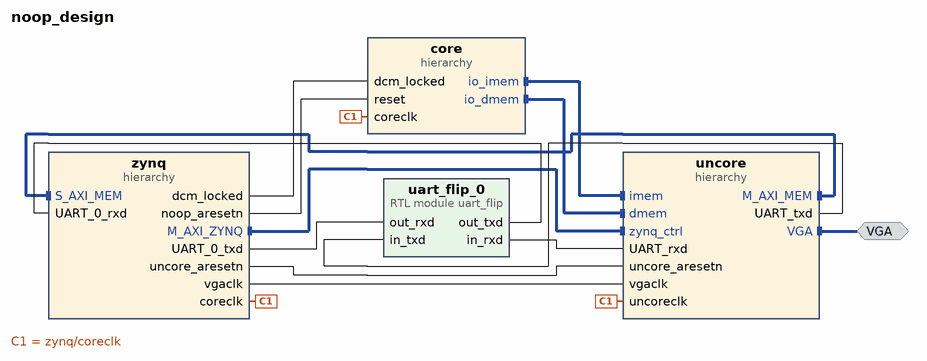
[diagram p0: block diagram of the top level]
# Vivado block design noop_design, xc7z020clg484-1, Vivado 2018.1
create_bd_design noop_design

create_bd_intf_port -mode Master -vlnv xilinx.com:interface:vga_rtl:1.0 VGA

create_bd_cell -type hier core
create_bd_cell -type hier zynq
create_bd_cell -type hier uncore
create_bd_cell -type module -reference uart_flip uart_flip_0

# ---- hierarchy /core ----
current_bd_instance /core
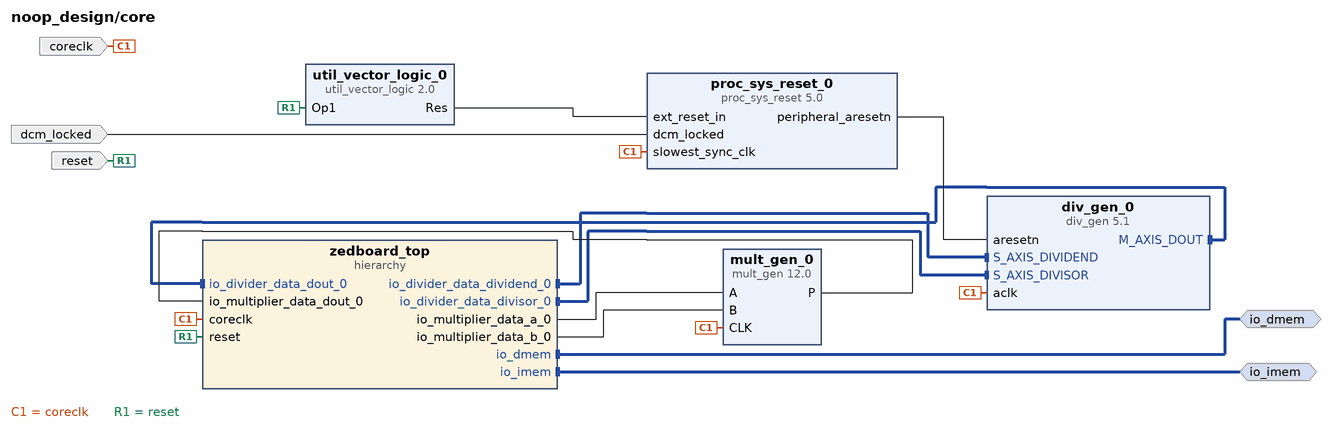
[diagram p1: block diagram inside /core]
create_bd_intf_pin -mode Master -vlnv xilinx.com:interface:aximm_rtl:1.0 io_dmem
create_bd_intf_pin -mode Master -vlnv xilinx.com:interface:aximm_rtl:1.0 io_imem
create_bd_pin -dir I -type clk coreclk
create_bd_pin -dir I -type rst reset
create_bd_pin -dir I dcm_locked

create_bd_cell -type ip -vlnv xilinx.com:ip:mult_gen:12.0 mult_gen_0
set_property -dict [list \
  CONFIG.PortAType Signed \
  CONFIG.PortAWidth 33 \
  CONFIG.PortBWidth 33 \
  CONFIG.Multiplier_Construction Use_Mults \
  CONFIG.OptGoal Area \
  CONFIG.PipeStages 7 \
] [get_bd_cells mult_gen_0]
create_bd_cell -type ip -vlnv xilinx.com:ip:util_vector_logic:2.0 util_vector_logic_0
set_property -dict {CONFIG.C_SIZE 1 CONFIG.C_OPERATION not} [get_bd_cells util_vector_logic_0]
create_bd_cell -type ip -vlnv xilinx.com:ip:div_gen:5.1 div_gen_0
set_property -dict [list \
  CONFIG.algorithm_type Radix2 \
  CONFIG.dividend_and_quotient_width 40 \
  CONFIG.divisor_width 40 \
  CONFIG.divisor_has_tlast false \
  CONFIG.remainder_type Remainder \
  CONFIG.fractional_width 40 \
  CONFIG.clocks_per_division 8 \
  CONFIG.divide_by_zero_detect false \
  CONFIG.FlowControl Blocking \
  CONFIG.OptimizeGoal Resources \
  CONFIG.OutTready false \
  CONFIG.OutTLASTBehv Null \
  CONFIG.latency_configuration Automatic \
  CONFIG.latency 46 \
  CONFIG.ARESETN true \
] [get_bd_cells div_gen_0]
create_bd_cell -type ip -vlnv xilinx.com:ip:proc_sys_reset:5.0 proc_sys_reset_0
create_bd_cell -type hier zedboard_top

# ---- hierarchy /core/zedboard_top ----
current_bd_instance /core/zedboard_top
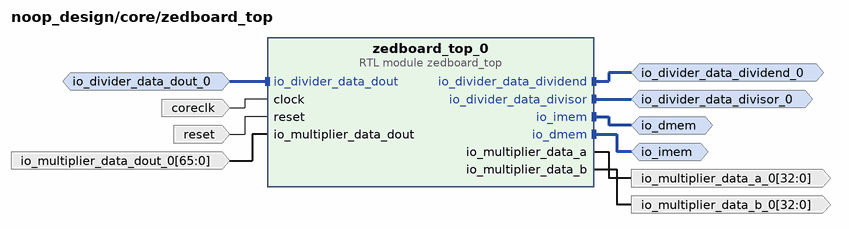
[diagram p2: block diagram inside /core/zedboard_top]
create_bd_intf_pin -mode Master -vlnv xilinx.com:interface:aximm_rtl:1.0 io_dmem
create_bd_intf_pin -mode Master -vlnv xilinx.com:interface:aximm_rtl:1.0 io_imem
create_bd_intf_pin -mode Master -vlnv xilinx.com:interface:axis_rtl:1.0 io_divider_data_dividend_0
create_bd_intf_pin -mode Master -vlnv xilinx.com:interface:axis_rtl:1.0 io_divider_data_divisor_0
create_bd_intf_pin -mode Slave -vlnv xilinx.com:interface:axis_rtl:1.0 io_divider_data_dout_0
create_bd_pin -dir I -type clk coreclk
create_bd_pin -dir I -type rst reset
create_bd_pin -dir I -from 65 -to 0 io_multiplier_data_dout_0
create_bd_pin -dir O -from 32 -to 0 io_multiplier_data_a_0
create_bd_pin -dir O -from 32 -to 0 io_multiplier_data_b_0

create_bd_cell -type module -reference zedboard_top zedboard_top_0

# ---- hierarchy /zynq ----
current_bd_instance /zynq
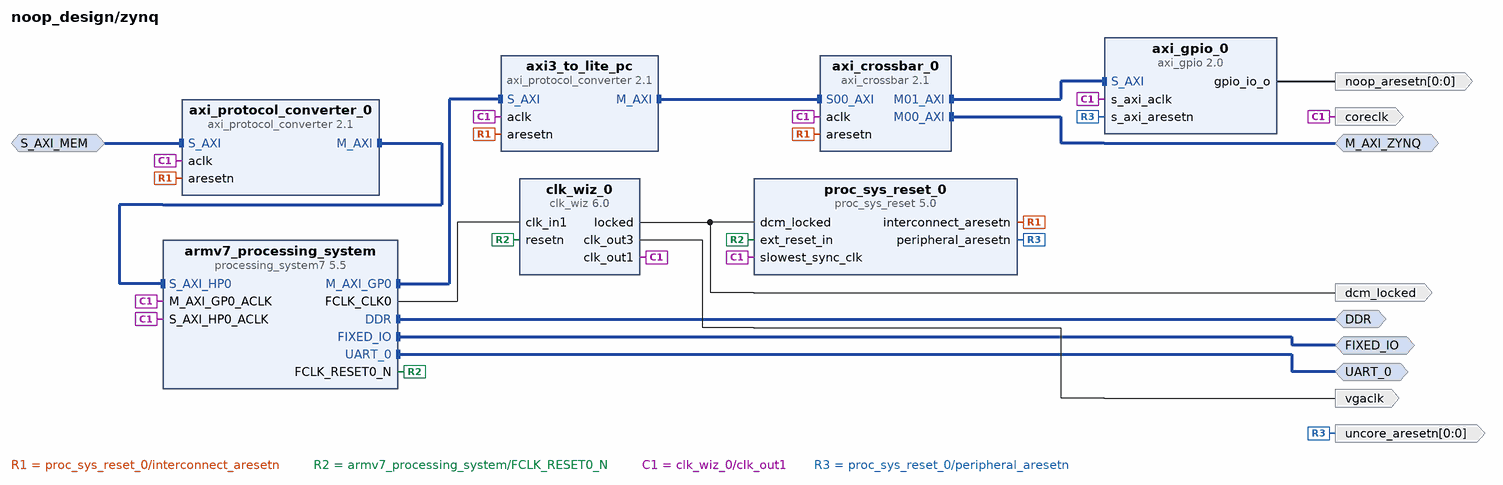
[diagram p3: block diagram inside /zynq]
create_bd_intf_pin -mode Slave -vlnv xilinx.com:interface:aximm_rtl:1.0 S_AXI_MEM
create_bd_intf_pin -mode Master -vlnv xilinx.com:interface:aximm_rtl:1.0 M_AXI_ZYNQ
create_bd_intf_pin -mode Master -vlnv xilinx.com:interface:ddrx_rtl:1.0 DDR
create_bd_intf_pin -mode Master -vlnv xilinx.com:display_processing_system7:fixedio_rtl:1.0 FIXED_IO
create_bd_intf_pin -mode Master -vlnv xilinx.com:interface:uart_rtl:1.0 UART_0
create_bd_pin -dir O -type clk coreclk
create_bd_pin -dir O -from 0 -to 0 -type rst uncore_aresetn
create_bd_pin -dir O -from 0 -to 0 noop_aresetn
create_bd_pin -dir O dcm_locked
create_bd_pin -dir O -type clk vgaclk

create_bd_cell -type ip -vlnv xilinx.com:ip:axi_protocol_converter:2.1 axi_protocol_converter_0
create_bd_cell -type ip -vlnv xilinx.com:ip:axi_crossbar:2.1 axi_crossbar_0
set_property -dict [list \
  CONFIG.M00_A00_BASE_ADDR 0xffffffffffffffff \
  CONFIG.M00_A01_BASE_ADDR 0xffffffffffffffff \
  CONFIG.M00_A02_BASE_ADDR 0xffffffffffffffff \
  CONFIG.M00_A03_BASE_ADDR 0xffffffffffffffff \
  CONFIG.M00_A04_BASE_ADDR 0xffffffffffffffff \
  CONFIG.M00_A05_BASE_ADDR 0xffffffffffffffff \
  CONFIG.M00_A06_BASE_ADDR 0xffffffffffffffff \
  CONFIG.M00_A07_BASE_ADDR 0xffffffffffffffff \
  CONFIG.M00_A08_BASE_ADDR 0xffffffffffffffff \
  CONFIG.M00_A09_BASE_ADDR 0xffffffffffffffff \
  CONFIG.M00_A10_BASE_ADDR 0xffffffffffffffff \
  CONFIG.M00_A11_BASE_ADDR 0xffffffffffffffff \
  CONFIG.M00_A12_BASE_ADDR 0xffffffffffffffff \
  CONFIG.M00_A13_BASE_ADDR 0xffffffffffffffff \
  CONFIG.M00_A14_BASE_ADDR 0xffffffffffffffff \
  CONFIG.M00_A15_BASE_ADDR 0xffffffffffffffff \
  CONFIG.M01_A00_BASE_ADDR 0xffffffffffffffff \
  CONFIG.M01_A01_BASE_ADDR 0xffffffffffffffff \
  CONFIG.M01_A02_BASE_ADDR 0xffffffffffffffff \
  CONFIG.M01_A03_BASE_ADDR 0xffffffffffffffff \
  CONFIG.M01_A04_BASE_ADDR 0xffffffffffffffff \
  CONFIG.M01_A05_BASE_ADDR 0xffffffffffffffff \
  CONFIG.M01_A06_BASE_ADDR 0xffffffffffffffff \
  CONFIG.M01_A07_BASE_ADDR 0xffffffffffffffff \
  CONFIG.M01_A08_BASE_ADDR 0xffffffffffffffff \
  CONFIG.M01_A09_BASE_ADDR 0xffffffffffffffff \
  CONFIG.M01_A10_BASE_ADDR 0xffffffffffffffff \
  CONFIG.M01_A11_BASE_ADDR 0xffffffffffffffff \
  CONFIG.M01_A12_BASE_ADDR 0xffffffffffffffff \
  CONFIG.M01_A13_BASE_ADDR 0xffffffffffffffff \
  CONFIG.M01_A14_BASE_ADDR 0xffffffffffffffff \
  CONFIG.M01_A15_BASE_ADDR 0xffffffffffffffff \
  CONFIG.M02_A00_BASE_ADDR 0xffffffffffffffff \
  CONFIG.M02_A01_BASE_ADDR 0xffffffffffffffff \
  CONFIG.M02_A02_BASE_ADDR 0xffffffffffffffff \
  CONFIG.M02_A03_BASE_ADDR 0xffffffffffffffff \
  CONFIG.M02_A04_BASE_ADDR 0xffffffffffffffff \
  CONFIG.M02_A05_BASE_ADDR 0xffffffffffffffff \
  CONFIG.M02_A06_BASE_ADDR 0xffffffffffffffff \
  CONFIG.M02_A07_BASE_ADDR 0xffffffffffffffff \
  CONFIG.M02_A08_BASE_ADDR 0xffffffffffffffff \
  CONFIG.M02_A09_BASE_ADDR 0xffffffffffffffff \
  CONFIG.M02_A10_BASE_ADDR 0xffffffffffffffff \
  CONFIG.M02_A11_BASE_ADDR 0xffffffffffffffff \
  CONFIG.M02_A12_BASE_ADDR 0xffffffffffffffff \
  CONFIG.M02_A13_BASE_ADDR 0xffffffffffffffff \
  CONFIG.M02_A14_BASE_ADDR 0xffffffffffffffff \
  CONFIG.M02_A15_BASE_ADDR 0xffffffffffffffff \
  CONFIG.M03_A00_BASE_ADDR 0xffffffffffffffff \
  CONFIG.M03_A01_BASE_ADDR 0xffffffffffffffff \
  CONFIG.M03_A02_BASE_ADDR 0xffffffffffffffff \
  CONFIG.M03_A03_BASE_ADDR 0xffffffffffffffff \
  CONFIG.M03_A04_BASE_ADDR 0xffffffffffffffff \
  CONFIG.M03_A05_BASE_ADDR 0xffffffffffffffff \
  CONFIG.M03_A06_BASE_ADDR 0xffffffffffffffff \
  CONFIG.M03_A07_BASE_ADDR 0xffffffffffffffff \
  CONFIG.M03_A08_BASE_ADDR 0xffffffffffffffff \
  CONFIG.M03_A09_BASE_ADDR 0xffffffffffffffff \
  CONFIG.M03_A10_BASE_ADDR 0xffffffffffffffff \
  CONFIG.M03_A11_BASE_ADDR 0xffffffffffffffff \
  CONFIG.M03_A12_BASE_ADDR 0xffffffffffffffff \
  CONFIG.M03_A13_BASE_ADDR 0xffffffffffffffff \
  CONFIG.M03_A14_BASE_ADDR 0xffffffffffffffff \
  CONFIG.M03_A15_BASE_ADDR 0xffffffffffffffff \
  CONFIG.M04_A00_BASE_ADDR 0xffffffffffffffff \
  CONFIG.M04_A01_BASE_ADDR 0xffffffffffffffff \
  CONFIG.M04_A02_BASE_ADDR 0xffffffffffffffff \
  CONFIG.M04_A03_BASE_ADDR 0xffffffffffffffff \
  CONFIG.M04_A04_BASE_ADDR 0xffffffffffffffff \
  CONFIG.M04_A05_BASE_ADDR 0xffffffffffffffff \
  CONFIG.M04_A06_BASE_ADDR 0xffffffffffffffff \
  CONFIG.M04_A07_BASE_ADDR 0xffffffffffffffff \
  CONFIG.M04_A08_BASE_ADDR 0xffffffffffffffff \
  CONFIG.M04_A09_BASE_ADDR 0xffffffffffffffff \
  CONFIG.M04_A10_BASE_ADDR 0xffffffffffffffff \
  CONFIG.M04_A11_BASE_ADDR 0xffffffffffffffff \
  CONFIG.M04_A12_BASE_ADDR 0xffffffffffffffff \
  CONFIG.M04_A13_BASE_ADDR 0xffffffffffffffff \
  CONFIG.M04_A14_BASE_ADDR 0xffffffffffffffff \
  CONFIG.M04_A15_BASE_ADDR 0xffffffffffffffff \
  CONFIG.M05_A00_BASE_ADDR 0xffffffffffffffff \
  CONFIG.M05_A01_BASE_ADDR 0xffffffffffffffff \
  CONFIG.M05_A02_BASE_ADDR 0xffffffffffffffff \
  CONFIG.M05_A03_BASE_ADDR 0xffffffffffffffff \
  CONFIG.M05_A04_BASE_ADDR 0xffffffffffffffff \
  CONFIG.M05_A05_BASE_ADDR 0xffffffffffffffff \
  CONFIG.M05_A06_BASE_ADDR 0xffffffffffffffff \
  CONFIG.M05_A07_BASE_ADDR 0xffffffffffffffff \
  CONFIG.M05_A08_BASE_ADDR 0xffffffffffffffff \
  CONFIG.M05_A09_BASE_ADDR 0xffffffffffffffff \
  CONFIG.M05_A10_BASE_ADDR 0xffffffffffffffff \
  CONFIG.M05_A11_BASE_ADDR 0xffffffffffffffff \
  CONFIG.M05_A12_BASE_ADDR 0xffffffffffffffff \
  CONFIG.M05_A13_BASE_ADDR 0xffffffffffffffff \
  CONFIG.M05_A14_BASE_ADDR 0xffffffffffffffff \
  CONFIG.M05_A15_BASE_ADDR 0xffffffffffffffff \
  CONFIG.M06_A00_BASE_ADDR 0xffffffffffffffff \
  CONFIG.M06_A01_BASE_ADDR 0xffffffffffffffff \
  CONFIG.M06_A02_BASE_ADDR 0xffffffffffffffff \
  CONFIG.M06_A03_BASE_ADDR 0xffffffffffffffff \
  CONFIG.M06_A04_BASE_ADDR 0xffffffffffffffff \
  CONFIG.M06_A05_BASE_ADDR 0xffffffffffffffff \
  CONFIG.M06_A06_BASE_ADDR 0xffffffffffffffff \
  CONFIG.M06_A07_BASE_ADDR 0xffffffffffffffff \
  CONFIG.M06_A08_BASE_ADDR 0xffffffffffffffff \
  CONFIG.M06_A09_BASE_ADDR 0xffffffffffffffff \
  CONFIG.M06_A10_BASE_ADDR 0xffffffffffffffff \
  CONFIG.M06_A11_BASE_ADDR 0xffffffffffffffff \
  CONFIG.M06_A12_BASE_ADDR 0xffffffffffffffff \
  CONFIG.M06_A13_BASE_ADDR 0xffffffffffffffff \
  CONFIG.M06_A14_BASE_ADDR 0xffffffffffffffff \
  CONFIG.M06_A15_BASE_ADDR 0xffffffffffffffff \
  CONFIG.M07_A00_BASE_ADDR 0xffffffffffffffff \
  CONFIG.M07_A01_BASE_ADDR 0xffffffffffffffff \
  CONFIG.M07_A02_BASE_ADDR 0xffffffffffffffff \
  CONFIG.M07_A03_BASE_ADDR 0xffffffffffffffff \
  CONFIG.M07_A04_BASE_ADDR 0xffffffffffffffff \
  CONFIG.M07_A05_BASE_ADDR 0xffffffffffffffff \
  CONFIG.M07_A06_BASE_ADDR 0xffffffffffffffff \
  CONFIG.M07_A07_BASE_ADDR 0xffffffffffffffff \
  CONFIG.M07_A08_BASE_ADDR 0xffffffffffffffff \
  CONFIG.M07_A09_BASE_ADDR 0xffffffffffffffff \
  CONFIG.M07_A10_BASE_ADDR 0xffffffffffffffff \
  CONFIG.M07_A11_BASE_ADDR 0xffffffffffffffff \
  CONFIG.M07_A12_BASE_ADDR 0xffffffffffffffff \
  CONFIG.M07_A13_BASE_ADDR 0xffffffffffffffff \
  CONFIG.M07_A14_BASE_ADDR 0xffffffffffffffff \
  CONFIG.M07_A15_BASE_ADDR 0xffffffffffffffff \
  CONFIG.M08_A00_BASE_ADDR 0xffffffffffffffff \
  CONFIG.M08_A01_BASE_ADDR 0xffffffffffffffff \
  CONFIG.M08_A02_BASE_ADDR 0xffffffffffffffff \
  CONFIG.M08_A03_BASE_ADDR 0xffffffffffffffff \
  CONFIG.M08_A04_BASE_ADDR 0xffffffffffffffff \
  CONFIG.M08_A05_BASE_ADDR 0xffffffffffffffff \
  CONFIG.M08_A06_BASE_ADDR 0xffffffffffffffff \
  CONFIG.M08_A07_BASE_ADDR 0xffffffffffffffff \
  CONFIG.M08_A08_BASE_ADDR 0xffffffffffffffff \
  CONFIG.M08_A09_BASE_ADDR 0xffffffffffffffff \
  CONFIG.M08_A10_BASE_ADDR 0xffffffffffffffff \
  CONFIG.M08_A11_BASE_ADDR 0xffffffffffffffff \
  CONFIG.M08_A12_BASE_ADDR 0xffffffffffffffff \
  CONFIG.M08_A13_BASE_ADDR 0xffffffffffffffff \
  CONFIG.M08_A14_BASE_ADDR 0xffffffffffffffff \
  CONFIG.M08_A15_BASE_ADDR 0xffffffffffffffff \
  CONFIG.M09_A00_BASE_ADDR 0xffffffffffffffff \
  CONFIG.M09_A01_BASE_ADDR 0xffffffffffffffff \
  CONFIG.M09_A02_BASE_ADDR 0xffffffffffffffff \
  CONFIG.M09_A03_BASE_ADDR 0xffffffffffffffff \
  CONFIG.M09_A04_BASE_ADDR 0xffffffffffffffff \
  CONFIG.M09_A05_BASE_ADDR 0xffffffffffffffff \
  CONFIG.M09_A06_BASE_ADDR 0xffffffffffffffff \
  CONFIG.M09_A07_BASE_ADDR 0xffffffffffffffff \
  CONFIG.M09_A08_BASE_ADDR 0xffffffffffffffff \
  CONFIG.M09_A09_BASE_ADDR 0xffffffffffffffff \
  CONFIG.M09_A10_BASE_ADDR 0xffffffffffffffff \
  CONFIG.M09_A11_BASE_ADDR 0xffffffffffffffff \
  CONFIG.M09_A12_BASE_ADDR 0xffffffffffffffff \
  CONFIG.M09_A13_BASE_ADDR 0xffffffffffffffff \
  CONFIG.M09_A14_BASE_ADDR 0xffffffffffffffff \
  CONFIG.M09_A15_BASE_ADDR 0xffffffffffffffff \
  CONFIG.M10_A00_BASE_ADDR 0xffffffffffffffff \
  CONFIG.M10_A01_BASE_ADDR 0xffffffffffffffff \
  CONFIG.M10_A02_BASE_ADDR 0xffffffffffffffff \
  CONFIG.M10_A03_BASE_ADDR 0xffffffffffffffff \
  CONFIG.M10_A04_BASE_ADDR 0xffffffffffffffff \
  CONFIG.M10_A05_BASE_ADDR 0xffffffffffffffff \
  CONFIG.M10_A06_BASE_ADDR 0xffffffffffffffff \
  CONFIG.M10_A07_BASE_ADDR 0xffffffffffffffff \
  CONFIG.M10_A08_BASE_ADDR 0xffffffffffffffff \
  CONFIG.M10_A09_BASE_ADDR 0xffffffffffffffff \
  CONFIG.M10_A10_BASE_ADDR 0xffffffffffffffff \
  CONFIG.M10_A11_BASE_ADDR 0xffffffffffffffff \
  CONFIG.M10_A12_BASE_ADDR 0xffffffffffffffff \
  CONFIG.M10_A13_BASE_ADDR 0xffffffffffffffff \
  CONFIG.M10_A14_BASE_ADDR 0xffffffffffffffff \
  CONFIG.M10_A15_BASE_ADDR 0xffffffffffffffff \
  CONFIG.M11_A00_BASE_ADDR 0xffffffffffffffff \
  CONFIG.M11_A01_BASE_ADDR 0xffffffffffffffff \
  CONFIG.M11_A02_BASE_ADDR 0xffffffffffffffff \
  CONFIG.M11_A03_BASE_ADDR 0xffffffffffffffff \
  CONFIG.M11_A04_BASE_ADDR 0xffffffffffffffff \
  CONFIG.M11_A05_BASE_ADDR 0xffffffffffffffff \
  CONFIG.M11_A06_BASE_ADDR 0xffffffffffffffff \
  CONFIG.M11_A07_BASE_ADDR 0xffffffffffffffff \
  CONFIG.M11_A08_BASE_ADDR 0xffffffffffffffff \
  CONFIG.M11_A09_BASE_ADDR 0xffffffffffffffff \
  CONFIG.M11_A10_BASE_ADDR 0xffffffffffffffff \
  CONFIG.M11_A11_BASE_ADDR 0xffffffffffffffff \
  CONFIG.M11_A12_BASE_ADDR 0xffffffffffffffff \
  CONFIG.M11_A13_BASE_ADDR 0xffffffffffffffff \
  CONFIG.M11_A14_BASE_ADDR 0xffffffffffffffff \
  CONFIG.M11_A15_BASE_ADDR 0xffffffffffffffff \
  CONFIG.M12_A00_BASE_ADDR 0xffffffffffffffff \
  CONFIG.M12_A01_BASE_ADDR 0xffffffffffffffff \
  CONFIG.M12_A02_BASE_ADDR 0xffffffffffffffff \
  CONFIG.M12_A03_BASE_ADDR 0xffffffffffffffff \
  CONFIG.M12_A04_BASE_ADDR 0xffffffffffffffff \
  CONFIG.M12_A05_BASE_ADDR 0xffffffffffffffff \
  CONFIG.M12_A06_BASE_ADDR 0xffffffffffffffff \
  CONFIG.M12_A07_BASE_ADDR 0xffffffffffffffff \
  CONFIG.M12_A08_BASE_ADDR 0xffffffffffffffff \
  CONFIG.M12_A09_BASE_ADDR 0xffffffffffffffff \
  CONFIG.M12_A10_BASE_ADDR 0xffffffffffffffff \
  CONFIG.M12_A11_BASE_ADDR 0xffffffffffffffff \
  CONFIG.M12_A12_BASE_ADDR 0xffffffffffffffff \
  CONFIG.M12_A13_BASE_ADDR 0xffffffffffffffff \
  CONFIG.M12_A14_BASE_ADDR 0xffffffffffffffff \
  CONFIG.M12_A15_BASE_ADDR 0xffffffffffffffff \
  CONFIG.M13_A00_BASE_ADDR 0xffffffffffffffff \
  CONFIG.M13_A01_BASE_ADDR 0xffffffffffffffff \
  CONFIG.M13_A02_BASE_ADDR 0xffffffffffffffff \
  CONFIG.M13_A03_BASE_ADDR 0xffffffffffffffff \
  CONFIG.M13_A04_BASE_ADDR 0xffffffffffffffff \
  CONFIG.M13_A05_BASE_ADDR 0xffffffffffffffff \
  CONFIG.M13_A06_BASE_ADDR 0xffffffffffffffff \
  CONFIG.M13_A07_BASE_ADDR 0xffffffffffffffff \
  CONFIG.M13_A08_BASE_ADDR 0xffffffffffffffff \
  CONFIG.M13_A09_BASE_ADDR 0xffffffffffffffff \
  CONFIG.M13_A10_BASE_ADDR 0xffffffffffffffff \
  CONFIG.M13_A11_BASE_ADDR 0xffffffffffffffff \
  CONFIG.M13_A12_BASE_ADDR 0xffffffffffffffff \
  CONFIG.M13_A13_BASE_ADDR 0xffffffffffffffff \
  CONFIG.M13_A14_BASE_ADDR 0xffffffffffffffff \
  CONFIG.M13_A15_BASE_ADDR 0xffffffffffffffff \
  CONFIG.M14_A00_BASE_ADDR 0xffffffffffffffff \
  CONFIG.M14_A01_BASE_ADDR 0xffffffffffffffff \
  CONFIG.M14_A02_BASE_ADDR 0xffffffffffffffff \
  CONFIG.M14_A03_BASE_ADDR 0xffffffffffffffff \
  CONFIG.M14_A04_BASE_ADDR 0xffffffffffffffff \
  CONFIG.M14_A05_BASE_ADDR 0xffffffffffffffff \
  CONFIG.M14_A06_BASE_ADDR 0xffffffffffffffff \
  CONFIG.M14_A07_BASE_ADDR 0xffffffffffffffff \
  CONFIG.M14_A08_BASE_ADDR 0xffffffffffffffff \
  CONFIG.M14_A09_BASE_ADDR 0xffffffffffffffff \
  CONFIG.M14_A10_BASE_ADDR 0xffffffffffffffff \
  CONFIG.M14_A11_BASE_ADDR 0xffffffffffffffff \
  CONFIG.M14_A12_BASE_ADDR 0xffffffffffffffff \
  CONFIG.M14_A13_BASE_ADDR 0xffffffffffffffff \
  CONFIG.M14_A14_BASE_ADDR 0xffffffffffffffff \
  CONFIG.M14_A15_BASE_ADDR 0xffffffffffffffff \
  CONFIG.M15_A00_BASE_ADDR 0xffffffffffffffff \
  CONFIG.M15_A01_BASE_ADDR 0xffffffffffffffff \
  CONFIG.M15_A02_BASE_ADDR 0xffffffffffffffff \
  CONFIG.M15_A03_BASE_ADDR 0xffffffffffffffff \
  CONFIG.M15_A04_BASE_ADDR 0xffffffffffffffff \
  CONFIG.M15_A05_BASE_ADDR 0xffffffffffffffff \
  CONFIG.M15_A06_BASE_ADDR 0xffffffffffffffff \
  CONFIG.M15_A07_BASE_ADDR 0xffffffffffffffff \
  CONFIG.M15_A08_BASE_ADDR 0xffffffffffffffff \
  CONFIG.M15_A09_BASE_ADDR 0xffffffffffffffff \
  CONFIG.M15_A10_BASE_ADDR 0xffffffffffffffff \
  CONFIG.M15_A11_BASE_ADDR 0xffffffffffffffff \
  CONFIG.M15_A12_BASE_ADDR 0xffffffffffffffff \
  CONFIG.M15_A13_BASE_ADDR 0xffffffffffffffff \
  CONFIG.M15_A14_BASE_ADDR 0xffffffffffffffff \
  CONFIG.M15_A15_BASE_ADDR 0xffffffffffffffff \
  CONFIG.M00_A00_ADDR_WIDTH 0 \
  CONFIG.M01_A00_ADDR_WIDTH 0 \
  CONFIG.M02_A00_ADDR_WIDTH 0 \
  CONFIG.M03_A00_ADDR_WIDTH 0 \
  CONFIG.M04_A00_ADDR_WIDTH 0 \
  CONFIG.M05_A00_ADDR_WIDTH 0 \
  CONFIG.M06_A00_ADDR_WIDTH 0 \
  CONFIG.M07_A00_ADDR_WIDTH 0 \
  CONFIG.M08_A00_ADDR_WIDTH 0 \
  CONFIG.M09_A00_ADDR_WIDTH 0 \
  CONFIG.M10_A00_ADDR_WIDTH 0 \
  CONFIG.M11_A00_ADDR_WIDTH 0 \
  CONFIG.M12_A00_ADDR_WIDTH 0 \
  CONFIG.M13_A00_ADDR_WIDTH 0 \
  CONFIG.M14_A00_ADDR_WIDTH 0 \
  CONFIG.M15_A00_ADDR_WIDTH 0 \
] [get_bd_cells axi_crossbar_0]
create_bd_cell -type ip -vlnv xilinx.com:ip:axi_protocol_converter:2.1 axi3_to_lite_pc
set_property -dict {CONFIG.TRANSLATION_MODE 2} [get_bd_cells axi3_to_lite_pc]
create_bd_cell -type ip -vlnv xilinx.com:ip:processing_system7:5.5 armv7_processing_system
set_property -dict [list \
  CONFIG.PCW_UIPARAM_DDR_FREQ_MHZ 533.333333 \
  CONFIG.PCW_APU_PERIPHERAL_FREQMHZ 667 \
  CONFIG.PCW_SDIO_PERIPHERAL_FREQMHZ 100 \
  CONFIG.PCW_UART_PERIPHERAL_FREQMHZ 100 \
  CONFIG.PCW_FPGA0_PERIPHERAL_FREQMHZ 100 \
  CONFIG.PCW_FPGA1_PERIPHERAL_FREQMHZ 50 \
  CONFIG.PCW_USE_S_AXI_HP0 1 \
  CONFIG.PCW_M_AXI_GP0_ENABLE_STATIC_REMAP 1 \
  CONFIG.PCW_M_AXI_GP0_THREAD_ID_WIDTH 6 \
  CONFIG.PCW_S_AXI_HP0_DATA_WIDTH 32 \
  CONFIG.PCW_GP0_EN_MODIFIABLE_TXN 0 \
  CONFIG.PCW_GP1_EN_MODIFIABLE_TXN 0 \
  CONFIG.PCW_PERIPHERAL_BOARD_PRESET part0 \
  CONFIG.PCW_PRESET_BANK1_VOLTAGE {LVCMOS 1.8V} \
  CONFIG.PCW_UIPARAM_DDR_PARTNO Custom \
  CONFIG.PCW_QSPI_PERIPHERAL_ENABLE 1 \
  CONFIG.PCW_QSPI_QSPI_IO {MIO 1 .. 6} \
  CONFIG.PCW_QSPI_GRP_SINGLE_SS_ENABLE 1 \
  CONFIG.PCW_QSPI_GRP_SINGLE_SS_IO {MIO 1 .. 6} \
  CONFIG.PCW_SINGLE_QSPI_DATA_MODE x4 \
  CONFIG.PCW_ENET0_PERIPHERAL_ENABLE 1 \
  CONFIG.PCW_ENET0_ENET0_IO {MIO 16 .. 27} \
  CONFIG.PCW_ENET0_GRP_MDIO_ENABLE 1 \
  CONFIG.PCW_ENET0_GRP_MDIO_IO {MIO 52 .. 53} \
  CONFIG.PCW_SD0_PERIPHERAL_ENABLE 1 \
  CONFIG.PCW_SD0_SD0_IO {MIO 40 .. 45} \
  CONFIG.PCW_SD0_GRP_CD_ENABLE 1 \
  CONFIG.PCW_SD0_GRP_CD_IO {MIO 47} \
  CONFIG.PCW_SD0_GRP_WP_ENABLE 1 \
  CONFIG.PCW_SD0_GRP_WP_IO EMIO \
  CONFIG.PCW_UART0_PERIPHERAL_ENABLE 1 \
  CONFIG.PCW_UART0_UART0_IO EMIO \
  CONFIG.PCW_UART1_PERIPHERAL_ENABLE 1 \
  CONFIG.PCW_UART1_UART1_IO {MIO 48 .. 49} \
  CONFIG.PCW_WDT_PERIPHERAL_ENABLE 1 \
  CONFIG.PCW_WDT_WDT_IO EMIO \
  CONFIG.PCW_USB0_PERIPHERAL_ENABLE 1 \
  CONFIG.PCW_USB0_USB0_IO {MIO 28 .. 39} \
  CONFIG.PCW_GPIO_MIO_GPIO_ENABLE 0 \
] [get_bd_cells armv7_processing_system]
# 473 more settings of armv7_processing_system are not shown: defaults, MIO pin electricals, DDR timing, and values the tool derives
create_bd_cell -type ip -vlnv xilinx.com:ip:axi_gpio:2.0 axi_gpio_0
set_property -dict {CONFIG.C_GPIO_WIDTH 1 CONFIG.C_ALL_OUTPUTS 1} [get_bd_cells axi_gpio_0]
create_bd_cell -type ip -vlnv xilinx.com:ip:proc_sys_reset:5.0 proc_sys_reset_0
create_bd_cell -type ip -vlnv xilinx.com:ip:clk_wiz:6.0 clk_wiz_0
set_property -dict [list \
  CONFIG.CLKOUT2_USED true \
  CONFIG.CLKOUT3_USED true \
  CONFIG.NUM_OUT_CLKS 3 \
  CONFIG.CLKOUT1_REQUESTED_OUT_FREQ 90 \
  CONFIG.CLKOUT2_REQUESTED_OUT_FREQ 90 \
  CONFIG.CLKOUT3_REQUESTED_OUT_FREQ 50 \
  CONFIG.RESET_PORT resetn \
  CONFIG.MMCM_DIVCLK_DIVIDE 1 \
  CONFIG.MMCM_CLKFBOUT_MULT_F 9.000 \
  CONFIG.MMCM_CLKOUT0_DIVIDE_F 10.000 \
  CONFIG.MMCM_CLKOUT1_DIVIDE 10 \
  CONFIG.MMCM_CLKOUT2_DIVIDE 18 \
  CONFIG.RESET_TYPE ACTIVE_LOW \
  CONFIG.CLKOUT1_JITTER 140.709 \
  CONFIG.CLKOUT1_PHASE_ERROR 105.461 \
  CONFIG.CLKOUT2_JITTER 140.709 \
  CONFIG.CLKOUT2_PHASE_ERROR 105.461 \
  CONFIG.CLKOUT3_JITTER 159.475 \
  CONFIG.CLKOUT3_PHASE_ERROR 105.461 \
] [get_bd_cells clk_wiz_0]

# ---- hierarchy /uncore ----
current_bd_instance /uncore
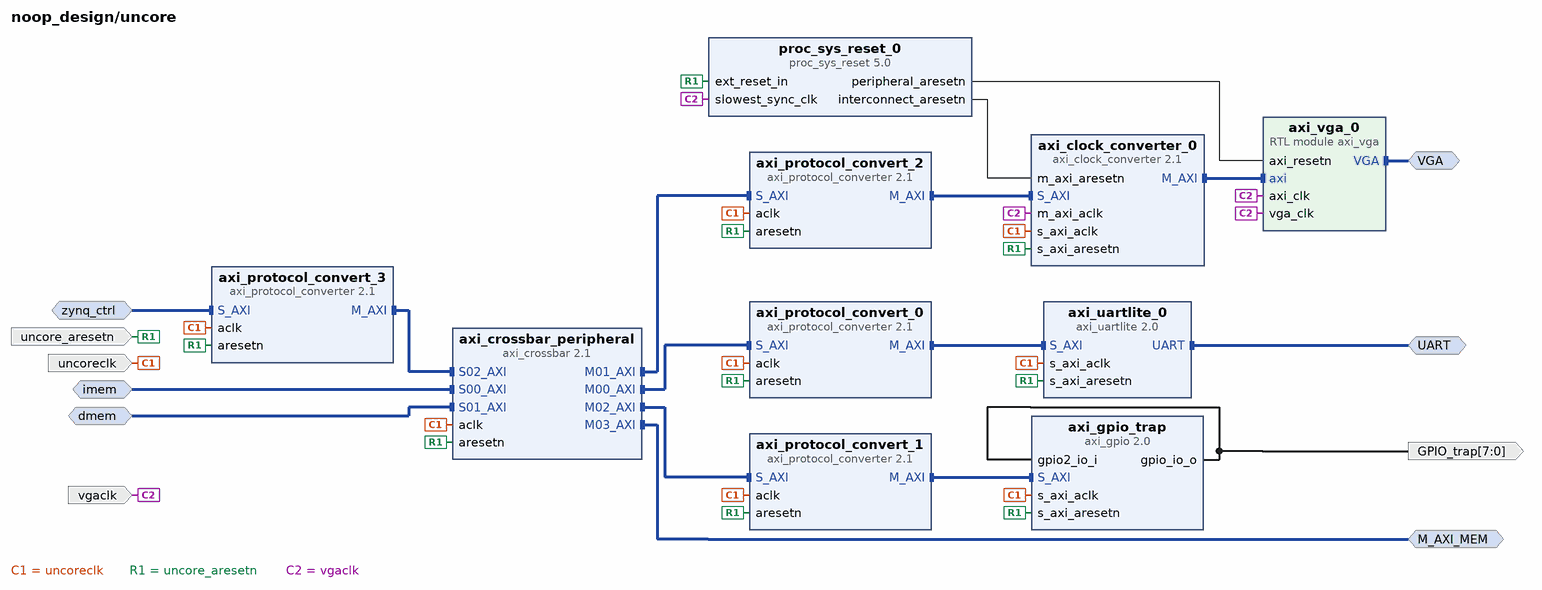
[diagram p4: block diagram inside /uncore]
create_bd_intf_pin -mode Master -vlnv xilinx.com:interface:vga_rtl:1.0 VGA
create_bd_intf_pin -mode Slave -vlnv xilinx.com:interface:aximm_rtl:1.0 imem
create_bd_intf_pin -mode Slave -vlnv xilinx.com:interface:aximm_rtl:1.0 dmem
create_bd_intf_pin -mode Master -vlnv xilinx.com:interface:uart_rtl:1.0 UART
create_bd_intf_pin -mode Master -vlnv xilinx.com:interface:aximm_rtl:1.0 M_AXI_MEM
create_bd_intf_pin -mode Slave -vlnv xilinx.com:interface:aximm_rtl:1.0 zynq_ctrl
create_bd_pin -dir I -type clk uncoreclk
create_bd_pin -dir I -type rst uncore_aresetn
create_bd_pin -dir O -from 7 -to 0 GPIO_trap
create_bd_pin -dir I -type clk vgaclk

create_bd_cell -type ip -vlnv xilinx.com:ip:axi_gpio:2.0 axi_gpio_trap
set_property -dict [list \
  CONFIG.C_GPIO2_WIDTH 8 \
  CONFIG.C_IS_DUAL 1 \
  CONFIG.C_DOUT_DEFAULT 0xffffffff \
  CONFIG.C_ALL_INPUTS_2 1 \
  CONFIG.USE_BOARD_FLOW true \
  CONFIG.GPIO_BOARD_INTERFACE leds_8bits \
] [get_bd_cells axi_gpio_trap]
create_bd_cell -type ip -vlnv xilinx.com:ip:axi_clock_converter:2.1 axi_clock_converter_0
create_bd_cell -type ip -vlnv xilinx.com:ip:proc_sys_reset:5.0 proc_sys_reset_0
create_bd_cell -type ip -vlnv xilinx.com:ip:axi_crossbar:2.1 axi_crossbar_peripheral
set_property -dict [list \
  CONFIG.NUM_SI 3 \
  CONFIG.NUM_MI 5 \
  CONFIG.PROTOCOL AXI4 \
  CONFIG.CONNECTIVITY_MODE SASD \
  CONFIG.R_REGISTER 1 \
  CONFIG.S03_WRITE_ACCEPTANCE 1 \
  CONFIG.S04_WRITE_ACCEPTANCE 1 \
  CONFIG.S05_WRITE_ACCEPTANCE 1 \
  CONFIG.S06_WRITE_ACCEPTANCE 1 \
  CONFIG.S07_WRITE_ACCEPTANCE 1 \
  CONFIG.S08_WRITE_ACCEPTANCE 1 \
  CONFIG.S09_WRITE_ACCEPTANCE 1 \
  CONFIG.S10_WRITE_ACCEPTANCE 1 \
  CONFIG.S11_WRITE_ACCEPTANCE 1 \
  CONFIG.S12_WRITE_ACCEPTANCE 1 \
  CONFIG.S13_WRITE_ACCEPTANCE 1 \
  CONFIG.S14_WRITE_ACCEPTANCE 1 \
  CONFIG.S15_WRITE_ACCEPTANCE 1 \
  CONFIG.S03_READ_ACCEPTANCE 1 \
  CONFIG.S04_READ_ACCEPTANCE 1 \
  CONFIG.S05_READ_ACCEPTANCE 1 \
  CONFIG.S06_READ_ACCEPTANCE 1 \
  CONFIG.S07_READ_ACCEPTANCE 1 \
  CONFIG.S08_READ_ACCEPTANCE 1 \
  CONFIG.S09_READ_ACCEPTANCE 1 \
  CONFIG.S10_READ_ACCEPTANCE 1 \
  CONFIG.S11_READ_ACCEPTANCE 1 \
  CONFIG.S12_READ_ACCEPTANCE 1 \
  CONFIG.S13_READ_ACCEPTANCE 1 \
  CONFIG.S14_READ_ACCEPTANCE 1 \
  CONFIG.S15_READ_ACCEPTANCE 1 \
  CONFIG.M05_WRITE_ISSUING 1 \
  CONFIG.M06_WRITE_ISSUING 1 \
  CONFIG.M07_WRITE_ISSUING 1 \
  CONFIG.M08_WRITE_ISSUING 1 \
  CONFIG.M09_WRITE_ISSUING 1 \
  CONFIG.M10_WRITE_ISSUING 1 \
  CONFIG.M11_WRITE_ISSUING 1 \
  CONFIG.M12_WRITE_ISSUING 1 \
  CONFIG.M13_WRITE_ISSUING 1 \
  CONFIG.M14_WRITE_ISSUING 1 \
  CONFIG.M15_WRITE_ISSUING 1 \
  CONFIG.M05_READ_ISSUING 1 \
  CONFIG.M06_READ_ISSUING 1 \
  CONFIG.M07_READ_ISSUING 1 \
  CONFIG.M08_READ_ISSUING 1 \
  CONFIG.M09_READ_ISSUING 1 \
  CONFIG.M10_READ_ISSUING 1 \
  CONFIG.M11_READ_ISSUING 1 \
  CONFIG.M12_READ_ISSUING 1 \
  CONFIG.M13_READ_ISSUING 1 \
  CONFIG.M14_READ_ISSUING 1 \
  CONFIG.M15_READ_ISSUING 1 \
  CONFIG.S00_SINGLE_THREAD 1 \
  CONFIG.S01_SINGLE_THREAD 1 \
  CONFIG.S02_SINGLE_THREAD 1 \
  CONFIG.M00_A01_BASE_ADDR 0xffffffffffffffff \
  CONFIG.M00_A02_BASE_ADDR 0xffffffffffffffff \
  CONFIG.M00_A03_BASE_ADDR 0xffffffffffffffff \
  CONFIG.M00_A04_BASE_ADDR 0xffffffffffffffff \
  CONFIG.M00_A05_BASE_ADDR 0xffffffffffffffff \
  CONFIG.M00_A06_BASE_ADDR 0xffffffffffffffff \
  CONFIG.M00_A07_BASE_ADDR 0xffffffffffffffff \
  CONFIG.M00_A08_BASE_ADDR 0xffffffffffffffff \
  CONFIG.M00_A09_BASE_ADDR 0xffffffffffffffff \
  CONFIG.M00_A10_BASE_ADDR 0xffffffffffffffff \
  CONFIG.M00_A11_BASE_ADDR 0xffffffffffffffff \
  CONFIG.M00_A12_BASE_ADDR 0xffffffffffffffff \
  CONFIG.M00_A13_BASE_ADDR 0xffffffffffffffff \
  CONFIG.M00_A14_BASE_ADDR 0xffffffffffffffff \
  CONFIG.M00_A15_BASE_ADDR 0xffffffffffffffff \
  CONFIG.M01_A01_BASE_ADDR 0xffffffffffffffff \
  CONFIG.M01_A02_BASE_ADDR 0xffffffffffffffff \
  CONFIG.M01_A03_BASE_ADDR 0xffffffffffffffff \
  CONFIG.M01_A04_BASE_ADDR 0xffffffffffffffff \
  CONFIG.M01_A05_BASE_ADDR 0xffffffffffffffff \
  CONFIG.M01_A06_BASE_ADDR 0xffffffffffffffff \
  CONFIG.M01_A07_BASE_ADDR 0xffffffffffffffff \
  CONFIG.M01_A08_BASE_ADDR 0xffffffffffffffff \
  CONFIG.M01_A09_BASE_ADDR 0xffffffffffffffff \
  CONFIG.M01_A10_BASE_ADDR 0xffffffffffffffff \
  CONFIG.M01_A11_BASE_ADDR 0xffffffffffffffff \
  CONFIG.M01_A12_BASE_ADDR 0xffffffffffffffff \
  CONFIG.M01_A13_BASE_ADDR 0xffffffffffffffff \
  CONFIG.M01_A14_BASE_ADDR 0xffffffffffffffff \
  CONFIG.M01_A15_BASE_ADDR 0xffffffffffffffff \
  CONFIG.M02_A01_BASE_ADDR 0xffffffffffffffff \
  CONFIG.M02_A02_BASE_ADDR 0xffffffffffffffff \
  CONFIG.M02_A03_BASE_ADDR 0xffffffffffffffff \
  CONFIG.M02_A04_BASE_ADDR 0xffffffffffffffff \
  CONFIG.M02_A05_BASE_ADDR 0xffffffffffffffff \
  CONFIG.M02_A06_BASE_ADDR 0xffffffffffffffff \
  CONFIG.M02_A07_BASE_ADDR 0xffffffffffffffff \
  CONFIG.M02_A08_BASE_ADDR 0xffffffffffffffff \
  CONFIG.M02_A09_BASE_ADDR 0xffffffffffffffff \
  CONFIG.M02_A10_BASE_ADDR 0xffffffffffffffff \
  CONFIG.M02_A11_BASE_ADDR 0xffffffffffffffff \
  CONFIG.M02_A12_BASE_ADDR 0xffffffffffffffff \
  CONFIG.M02_A13_BASE_ADDR 0xffffffffffffffff \
  CONFIG.M02_A14_BASE_ADDR 0xffffffffffffffff \
  CONFIG.M02_A15_BASE_ADDR 0xffffffffffffffff \
  CONFIG.M03_A00_BASE_ADDR 0xffffffffffffffff \
  CONFIG.M03_A01_BASE_ADDR 0xffffffffffffffff \
  CONFIG.M03_A02_BASE_ADDR 0xffffffffffffffff \
  CONFIG.M03_A03_BASE_ADDR 0xffffffffffffffff \
  CONFIG.M03_A04_BASE_ADDR 0xffffffffffffffff \
  CONFIG.M03_A05_BASE_ADDR 0xffffffffffffffff \
  CONFIG.M03_A06_BASE_ADDR 0xffffffffffffffff \
  CONFIG.M03_A07_BASE_ADDR 0xffffffffffffffff \
  CONFIG.M03_A08_BASE_ADDR 0xffffffffffffffff \
  CONFIG.M03_A09_BASE_ADDR 0xffffffffffffffff \
  CONFIG.M03_A10_BASE_ADDR 0xffffffffffffffff \
  CONFIG.M03_A11_BASE_ADDR 0xffffffffffffffff \
  CONFIG.M03_A12_BASE_ADDR 0xffffffffffffffff \
  CONFIG.M03_A13_BASE_ADDR 0xffffffffffffffff \
  CONFIG.M03_A14_BASE_ADDR 0xffffffffffffffff \
  CONFIG.M03_A15_BASE_ADDR 0xffffffffffffffff \
  CONFIG.M04_A00_BASE_ADDR 0xffffffffffffffff \
  CONFIG.M04_A01_BASE_ADDR 0xffffffffffffffff \
  CONFIG.M04_A02_BASE_ADDR 0xffffffffffffffff \
  CONFIG.M04_A03_BASE_ADDR 0xffffffffffffffff \
  CONFIG.M04_A04_BASE_ADDR 0xffffffffffffffff \
  CONFIG.M04_A05_BASE_ADDR 0xffffffffffffffff \
  CONFIG.M04_A06_BASE_ADDR 0xffffffffffffffff \
  CONFIG.M04_A07_BASE_ADDR 0xffffffffffffffff \
  CONFIG.M04_A08_BASE_ADDR 0xffffffffffffffff \
  CONFIG.M04_A09_BASE_ADDR 0xffffffffffffffff \
  CONFIG.M04_A10_BASE_ADDR 0xffffffffffffffff \
  CONFIG.M04_A11_BASE_ADDR 0xffffffffffffffff \
  CONFIG.M04_A12_BASE_ADDR 0xffffffffffffffff \
  CONFIG.M04_A13_BASE_ADDR 0xffffffffffffffff \
  CONFIG.M04_A14_BASE_ADDR 0xffffffffffffffff \
  CONFIG.M04_A15_BASE_ADDR 0xffffffffffffffff \
  CONFIG.M05_A00_BASE_ADDR 0xffffffffffffffff \
  CONFIG.M05_A01_BASE_ADDR 0xffffffffffffffff \
  CONFIG.M05_A02_BASE_ADDR 0xffffffffffffffff \
  CONFIG.M05_A03_BASE_ADDR 0xffffffffffffffff \
  CONFIG.M05_A04_BASE_ADDR 0xffffffffffffffff \
  CONFIG.M05_A05_BASE_ADDR 0xffffffffffffffff \
  CONFIG.M05_A06_BASE_ADDR 0xffffffffffffffff \
  CONFIG.M05_A07_BASE_ADDR 0xffffffffffffffff \
  CONFIG.M05_A08_BASE_ADDR 0xffffffffffffffff \
  CONFIG.M05_A09_BASE_ADDR 0xffffffffffffffff \
  CONFIG.M05_A10_BASE_ADDR 0xffffffffffffffff \
  CONFIG.M05_A11_BASE_ADDR 0xffffffffffffffff \
  CONFIG.M05_A12_BASE_ADDR 0xffffffffffffffff \
  CONFIG.M05_A13_BASE_ADDR 0xffffffffffffffff \
  CONFIG.M05_A14_BASE_ADDR 0xffffffffffffffff \
  CONFIG.M05_A15_BASE_ADDR 0xffffffffffffffff \
  CONFIG.M06_A00_BASE_ADDR 0xffffffffffffffff \
  CONFIG.M06_A01_BASE_ADDR 0xffffffffffffffff \
  CONFIG.M06_A02_BASE_ADDR 0xffffffffffffffff \
  CONFIG.M06_A03_BASE_ADDR 0xffffffffffffffff \
  CONFIG.M06_A04_BASE_ADDR 0xffffffffffffffff \
  CONFIG.M06_A05_BASE_ADDR 0xffffffffffffffff \
  CONFIG.M06_A06_BASE_ADDR 0xffffffffffffffff \
  CONFIG.M06_A07_BASE_ADDR 0xffffffffffffffff \
  CONFIG.M06_A08_BASE_ADDR 0xffffffffffffffff \
  CONFIG.M06_A09_BASE_ADDR 0xffffffffffffffff \
  CONFIG.M06_A10_BASE_ADDR 0xffffffffffffffff \
  CONFIG.M06_A11_BASE_ADDR 0xffffffffffffffff \
  CONFIG.M06_A12_BASE_ADDR 0xffffffffffffffff \
  CONFIG.M06_A13_BASE_ADDR 0xffffffffffffffff \
  CONFIG.M06_A14_BASE_ADDR 0xffffffffffffffff \
  CONFIG.M06_A15_BASE_ADDR 0xffffffffffffffff \
  CONFIG.M07_A00_BASE_ADDR 0xffffffffffffffff \
  CONFIG.M07_A01_BASE_ADDR 0xffffffffffffffff \
  CONFIG.M07_A02_BASE_ADDR 0xffffffffffffffff \
  CONFIG.M07_A03_BASE_ADDR 0xffffffffffffffff \
  CONFIG.M07_A04_BASE_ADDR 0xffffffffffffffff \
  CONFIG.M07_A05_BASE_ADDR 0xffffffffffffffff \
  CONFIG.M07_A06_BASE_ADDR 0xffffffffffffffff \
  CONFIG.M07_A07_BASE_ADDR 0xffffffffffffffff \
  CONFIG.M07_A08_BASE_ADDR 0xffffffffffffffff \
  CONFIG.M07_A09_BASE_ADDR 0xffffffffffffffff \
  CONFIG.M07_A10_BASE_ADDR 0xffffffffffffffff \
  CONFIG.M07_A11_BASE_ADDR 0xffffffffffffffff \
  CONFIG.M07_A12_BASE_ADDR 0xffffffffffffffff \
  CONFIG.M07_A13_BASE_ADDR 0xffffffffffffffff \
  CONFIG.M07_A14_BASE_ADDR 0xffffffffffffffff \
  CONFIG.M07_A15_BASE_ADDR 0xffffffffffffffff \
  CONFIG.M08_A00_BASE_ADDR 0xffffffffffffffff \
  CONFIG.M08_A01_BASE_ADDR 0xffffffffffffffff \
  CONFIG.M08_A02_BASE_ADDR 0xffffffffffffffff \
  CONFIG.M08_A03_BASE_ADDR 0xffffffffffffffff \
  CONFIG.M08_A04_BASE_ADDR 0xffffffffffffffff \
  CONFIG.M08_A05_BASE_ADDR 0xffffffffffffffff \
  CONFIG.M08_A06_BASE_ADDR 0xffffffffffffffff \
  CONFIG.M08_A07_BASE_ADDR 0xffffffffffffffff \
  CONFIG.M08_A08_BASE_ADDR 0xffffffffffffffff \
  CONFIG.M08_A09_BASE_ADDR 0xffffffffffffffff \
  CONFIG.M08_A10_BASE_ADDR 0xffffffffffffffff \
  CONFIG.M08_A11_BASE_ADDR 0xffffffffffffffff \
  CONFIG.M08_A12_BASE_ADDR 0xffffffffffffffff \
  CONFIG.M08_A13_BASE_ADDR 0xffffffffffffffff \
  CONFIG.M08_A14_BASE_ADDR 0xffffffffffffffff \
  CONFIG.M08_A15_BASE_ADDR 0xffffffffffffffff \
  CONFIG.M09_A00_BASE_ADDR 0xffffffffffffffff \
  CONFIG.M09_A01_BASE_ADDR 0xffffffffffffffff \
  CONFIG.M09_A02_BASE_ADDR 0xffffffffffffffff \
  CONFIG.M09_A03_BASE_ADDR 0xffffffffffffffff \
  CONFIG.M09_A04_BASE_ADDR 0xffffffffffffffff \
  CONFIG.M09_A05_BASE_ADDR 0xffffffffffffffff \
  CONFIG.M09_A06_BASE_ADDR 0xffffffffffffffff \
  CONFIG.M09_A07_BASE_ADDR 0xffffffffffffffff \
  CONFIG.M09_A08_BASE_ADDR 0xffffffffffffffff \
  CONFIG.M09_A09_BASE_ADDR 0xffffffffffffffff \
  CONFIG.M09_A10_BASE_ADDR 0xffffffffffffffff \
  CONFIG.M09_A11_BASE_ADDR 0xffffffffffffffff \
  CONFIG.M09_A12_BASE_ADDR 0xffffffffffffffff \
  CONFIG.M09_A13_BASE_ADDR 0xffffffffffffffff \
  CONFIG.M09_A14_BASE_ADDR 0xffffffffffffffff \
  CONFIG.M09_A15_BASE_ADDR 0xffffffffffffffff \
  CONFIG.M10_A00_BASE_ADDR 0xffffffffffffffff \
  CONFIG.M10_A01_BASE_ADDR 0xffffffffffffffff \
  CONFIG.M10_A02_BASE_ADDR 0xffffffffffffffff \
  CONFIG.M10_A03_BASE_ADDR 0xffffffffffffffff \
  CONFIG.M10_A04_BASE_ADDR 0xffffffffffffffff \
  CONFIG.M10_A05_BASE_ADDR 0xffffffffffffffff \
  CONFIG.M10_A06_BASE_ADDR 0xffffffffffffffff \
  CONFIG.M10_A07_BASE_ADDR 0xffffffffffffffff \
  CONFIG.M10_A08_BASE_ADDR 0xffffffffffffffff \
  CONFIG.M10_A09_BASE_ADDR 0xffffffffffffffff \
  CONFIG.M10_A10_BASE_ADDR 0xffffffffffffffff \
  CONFIG.M10_A11_BASE_ADDR 0xffffffffffffffff \
  CONFIG.M10_A12_BASE_ADDR 0xffffffffffffffff \
  CONFIG.M10_A13_BASE_ADDR 0xffffffffffffffff \
  CONFIG.M10_A14_BASE_ADDR 0xffffffffffffffff \
  CONFIG.M10_A15_BASE_ADDR 0xffffffffffffffff \
  CONFIG.M11_A00_BASE_ADDR 0xffffffffffffffff \
  CONFIG.M11_A01_BASE_ADDR 0xffffffffffffffff \
  CONFIG.M11_A02_BASE_ADDR 0xffffffffffffffff \
  CONFIG.M11_A03_BASE_ADDR 0xffffffffffffffff \
  CONFIG.M11_A04_BASE_ADDR 0xffffffffffffffff \
  CONFIG.M11_A05_BASE_ADDR 0xffffffffffffffff \
  CONFIG.M11_A06_BASE_ADDR 0xffffffffffffffff \
  CONFIG.M11_A07_BASE_ADDR 0xffffffffffffffff \
  CONFIG.M11_A08_BASE_ADDR 0xffffffffffffffff \
  CONFIG.M11_A09_BASE_ADDR 0xffffffffffffffff \
  CONFIG.M11_A10_BASE_ADDR 0xffffffffffffffff \
  CONFIG.M11_A11_BASE_ADDR 0xffffffffffffffff \
  CONFIG.M11_A12_BASE_ADDR 0xffffffffffffffff \
  CONFIG.M11_A13_BASE_ADDR 0xffffffffffffffff \
  CONFIG.M11_A14_BASE_ADDR 0xffffffffffffffff \
  CONFIG.M11_A15_BASE_ADDR 0xffffffffffffffff \
  CONFIG.M12_A00_BASE_ADDR 0xffffffffffffffff \
  CONFIG.M12_A01_BASE_ADDR 0xffffffffffffffff \
  CONFIG.M12_A02_BASE_ADDR 0xffffffffffffffff \
  CONFIG.M12_A03_BASE_ADDR 0xffffffffffffffff \
  CONFIG.M12_A04_BASE_ADDR 0xffffffffffffffff \
  CONFIG.M12_A05_BASE_ADDR 0xffffffffffffffff \
  CONFIG.M12_A06_BASE_ADDR 0xffffffffffffffff \
  CONFIG.M12_A07_BASE_ADDR 0xffffffffffffffff \
  CONFIG.M12_A08_BASE_ADDR 0xffffffffffffffff \
  CONFIG.M12_A09_BASE_ADDR 0xffffffffffffffff \
  CONFIG.M12_A10_BASE_ADDR 0xffffffffffffffff \
  CONFIG.M12_A11_BASE_ADDR 0xffffffffffffffff \
  CONFIG.M12_A12_BASE_ADDR 0xffffffffffffffff \
  CONFIG.M12_A13_BASE_ADDR 0xffffffffffffffff \
  CONFIG.M12_A14_BASE_ADDR 0xffffffffffffffff \
  CONFIG.M12_A15_BASE_ADDR 0xffffffffffffffff \
  CONFIG.M13_A00_BASE_ADDR 0xffffffffffffffff \
  CONFIG.M13_A01_BASE_ADDR 0xffffffffffffffff \
  CONFIG.M13_A02_BASE_ADDR 0xffffffffffffffff \
  CONFIG.M13_A03_BASE_ADDR 0xffffffffffffffff \
  CONFIG.M13_A04_BASE_ADDR 0xffffffffffffffff \
  CONFIG.M13_A05_BASE_ADDR 0xffffffffffffffff \
  CONFIG.M13_A06_BASE_ADDR 0xffffffffffffffff \
  CONFIG.M13_A07_BASE_ADDR 0xffffffffffffffff \
  CONFIG.M13_A08_BASE_ADDR 0xffffffffffffffff \
  CONFIG.M13_A09_BASE_ADDR 0xffffffffffffffff \
  CONFIG.M13_A10_BASE_ADDR 0xffffffffffffffff \
  CONFIG.M13_A11_BASE_ADDR 0xffffffffffffffff \
  CONFIG.M13_A12_BASE_ADDR 0xffffffffffffffff \
  CONFIG.M13_A13_BASE_ADDR 0xffffffffffffffff \
  CONFIG.M13_A14_BASE_ADDR 0xffffffffffffffff \
  CONFIG.M13_A15_BASE_ADDR 0xffffffffffffffff \
  CONFIG.M14_A00_BASE_ADDR 0xffffffffffffffff \
  CONFIG.M14_A01_BASE_ADDR 0xffffffffffffffff \
  CONFIG.M14_A02_BASE_ADDR 0xffffffffffffffff \
  CONFIG.M14_A03_BASE_ADDR 0xffffffffffffffff \
  CONFIG.M14_A04_BASE_ADDR 0xffffffffffffffff \
  CONFIG.M14_A05_BASE_ADDR 0xffffffffffffffff \
  CONFIG.M14_A06_BASE_ADDR 0xffffffffffffffff \
  CONFIG.M14_A07_BASE_ADDR 0xffffffffffffffff \
  CONFIG.M14_A08_BASE_ADDR 0xffffffffffffffff \
  CONFIG.M14_A09_BASE_ADDR 0xffffffffffffffff \
  CONFIG.M14_A10_BASE_ADDR 0xffffffffffffffff \
  CONFIG.M14_A11_BASE_ADDR 0xffffffffffffffff \
  CONFIG.M14_A12_BASE_ADDR 0xffffffffffffffff \
  CONFIG.M14_A13_BASE_ADDR 0xffffffffffffffff \
  CONFIG.M14_A14_BASE_ADDR 0xffffffffffffffff \
  CONFIG.M14_A15_BASE_ADDR 0xffffffffffffffff \
  CONFIG.M15_A00_BASE_ADDR 0xffffffffffffffff \
  CONFIG.M15_A01_BASE_ADDR 0xffffffffffffffff \
  CONFIG.M15_A02_BASE_ADDR 0xffffffffffffffff \
  CONFIG.M15_A03_BASE_ADDR 0xffffffffffffffff \
  CONFIG.M15_A04_BASE_ADDR 0xffffffffffffffff \
  CONFIG.M15_A05_BASE_ADDR 0xffffffffffffffff \
  CONFIG.M15_A06_BASE_ADDR 0xffffffffffffffff \
  CONFIG.M15_A07_BASE_ADDR 0xffffffffffffffff \
  CONFIG.M15_A08_BASE_ADDR 0xffffffffffffffff \
  CONFIG.M15_A09_BASE_ADDR 0xffffffffffffffff \
  CONFIG.M15_A10_BASE_ADDR 0xffffffffffffffff \
  CONFIG.M15_A11_BASE_ADDR 0xffffffffffffffff \
  CONFIG.M15_A12_BASE_ADDR 0xffffffffffffffff \
  CONFIG.M15_A13_BASE_ADDR 0xffffffffffffffff \
  CONFIG.M15_A14_BASE_ADDR 0xffffffffffffffff \
  CONFIG.M15_A15_BASE_ADDR 0xffffffffffffffff \
  CONFIG.M03_A00_ADDR_WIDTH 0 \
  CONFIG.M04_A00_ADDR_WIDTH 0 \
  CONFIG.M05_A00_ADDR_WIDTH 0 \
  CONFIG.M06_A00_ADDR_WIDTH 0 \
  CONFIG.M07_A00_ADDR_WIDTH 0 \
  CONFIG.M08_A00_ADDR_WIDTH 0 \
  CONFIG.M09_A00_ADDR_WIDTH 0 \
  CONFIG.M10_A00_ADDR_WIDTH 0 \
  CONFIG.M11_A00_ADDR_WIDTH 0 \
  CONFIG.M12_A00_ADDR_WIDTH 0 \
  CONFIG.M13_A00_ADDR_WIDTH 0 \
  CONFIG.M14_A00_ADDR_WIDTH 0 \
  CONFIG.M15_A00_ADDR_WIDTH 0 \
] [get_bd_cells axi_crossbar_peripheral]
create_bd_cell -type ip -vlnv xilinx.com:ip:axi_uartlite:2.0 axi_uartlite_0
set_property -dict {CONFIG.C_BAUDRATE 115200 CONFIG.C_S_AXI_ACLK_FREQ_HZ 90000000} [get_bd_cells axi_uartlite_0]
create_bd_cell -type ip -vlnv xilinx.com:ip:axi_protocol_converter:2.1 axi_protocol_convert_0
create_bd_cell -type ip -vlnv xilinx.com:ip:axi_protocol_converter:2.1 axi_protocol_convert_1
create_bd_cell -type ip -vlnv xilinx.com:ip:axi_protocol_converter:2.1 axi_protocol_convert_2
create_bd_cell -type ip -vlnv xilinx.com:ip:axi_protocol_converter:2.1 axi_protocol_convert_3
set_property -dict [list \
  CONFIG.SI_PROTOCOL AXI4LITE \
  CONFIG.MI_PROTOCOL AXI4 \
  CONFIG.TRANSLATION_MODE 2 \
] [get_bd_cells axi_protocol_convert_3]
create_bd_cell -type module -reference axi_vga axi_vga_0

# ---- connections ----

current_bd_instance /core
connect_bd_intf_net [get_bd_intf_pins zedboard_top/io_divider_data_dividend_0] [get_bd_intf_pins div_gen_0/S_AXIS_DIVIDEND]
connect_bd_intf_net [get_bd_intf_pins zedboard_top/io_divider_data_divisor_0] [get_bd_intf_pins div_gen_0/S_AXIS_DIVISOR]
connect_bd_intf_net -intf_net io_divider_data_dout_0_1 [get_bd_intf_pins zedboard_top/io_divider_data_dout_0] [get_bd_intf_pins div_gen_0/M_AXIS_DOUT]
connect_bd_intf_net -intf_net FPGATop_0_io_dmem [get_bd_intf_pins io_dmem] [get_bd_intf_pins zedboard_top/io_dmem]
connect_bd_intf_net -intf_net FPGATop_0_io_imem [get_bd_intf_pins io_imem] [get_bd_intf_pins zedboard_top/io_imem]
connect_bd_net [get_bd_pins util_vector_logic_0/Res] [get_bd_pins proc_sys_reset_0/ext_reset_in]
connect_bd_net [get_bd_pins proc_sys_reset_0/peripheral_aresetn] [get_bd_pins div_gen_0/aresetn]
connect_bd_net -net uncoreclk_1 [get_bd_pins coreclk] \
  [get_bd_pins proc_sys_reset_0/slowest_sync_clk] [get_bd_pins div_gen_0/aclk] [get_bd_pins mult_gen_0/CLK] \
  [get_bd_pins zedboard_top/coreclk]
connect_bd_net [get_bd_pins reset] [get_bd_pins util_vector_logic_0/Op1] [get_bd_pins zedboard_top/reset]
connect_bd_net [get_bd_pins dcm_locked] [get_bd_pins proc_sys_reset_0/dcm_locked]
connect_bd_net [get_bd_pins mult_gen_0/P] [get_bd_pins zedboard_top/io_multiplier_data_dout_0]
connect_bd_net [get_bd_pins zedboard_top/io_multiplier_data_a_0] [get_bd_pins mult_gen_0/A]
connect_bd_net [get_bd_pins zedboard_top/io_multiplier_data_b_0] [get_bd_pins mult_gen_0/B]

current_bd_instance /core/zedboard_top
connect_bd_intf_net [get_bd_intf_pins io_dmem] [get_bd_intf_pins zedboard_top_0/io_imem]
connect_bd_intf_net [get_bd_intf_pins io_imem] [get_bd_intf_pins zedboard_top_0/io_dmem]
connect_bd_intf_net [get_bd_intf_pins io_divider_data_dividend_0] [get_bd_intf_pins zedboard_top_0/io_divider_data_dividend]
connect_bd_intf_net [get_bd_intf_pins io_divider_data_divisor_0] [get_bd_intf_pins zedboard_top_0/io_divider_data_divisor]
connect_bd_intf_net [get_bd_intf_pins io_divider_data_dout_0] [get_bd_intf_pins zedboard_top_0/io_divider_data_dout]
connect_bd_net [get_bd_pins coreclk] [get_bd_pins zedboard_top_0/clock]
connect_bd_net [get_bd_pins reset] [get_bd_pins zedboard_top_0/reset]
connect_bd_net -net io_multiplier_data_dout_0_1 [get_bd_pins io_multiplier_data_dout_0] [get_bd_pins zedboard_top_0/io_multiplier_data_dout]
connect_bd_net [get_bd_pins zedboard_top_0/io_multiplier_data_a] [get_bd_pins io_multiplier_data_a_0]
connect_bd_net [get_bd_pins zedboard_top_0/io_multiplier_data_b] [get_bd_pins io_multiplier_data_b_0]

current_bd_instance /zynq
connect_bd_intf_net [get_bd_intf_pins armv7_processing_system/S_AXI_HP0] [get_bd_intf_pins axi_protocol_converter_0/M_AXI]
connect_bd_intf_net [get_bd_intf_pins axi3_to_lite_pc/M_AXI] [get_bd_intf_pins axi_crossbar_0/S00_AXI]
connect_bd_intf_net [get_bd_intf_pins axi_crossbar_0/M01_AXI] [get_bd_intf_pins axi_gpio_0/S_AXI]
connect_bd_intf_net -intf_net armv7_ps_M_AXI_GP0 [get_bd_intf_pins armv7_processing_system/M_AXI_GP0] [get_bd_intf_pins axi3_to_lite_pc/S_AXI]
connect_bd_intf_net [get_bd_intf_pins S_AXI_MEM] [get_bd_intf_pins axi_protocol_converter_0/S_AXI]
connect_bd_intf_net [get_bd_intf_pins M_AXI_ZYNQ] [get_bd_intf_pins axi_crossbar_0/M00_AXI]
connect_bd_intf_net [get_bd_intf_pins DDR] [get_bd_intf_pins armv7_processing_system/DDR]
connect_bd_intf_net [get_bd_intf_pins FIXED_IO] [get_bd_intf_pins armv7_processing_system/FIXED_IO]
connect_bd_intf_net [get_bd_intf_pins UART_0] [get_bd_intf_pins armv7_processing_system/UART_0]
connect_bd_net -net ps_user_reset_n [get_bd_pins proc_sys_reset_0/interconnect_aresetn] \
  [get_bd_pins axi3_to_lite_pc/aresetn] [get_bd_pins axi_crossbar_0/aresetn] [get_bd_pins axi_protocol_converter_0/aresetn]
connect_bd_net [get_bd_pins armv7_processing_system/FCLK_CLK0] [get_bd_pins clk_wiz_0/clk_in1]
connect_bd_net [get_bd_pins armv7_processing_system/FCLK_RESET0_N] [get_bd_pins proc_sys_reset_0/ext_reset_in] [get_bd_pins clk_wiz_0/resetn]
connect_bd_net [get_bd_pins clk_wiz_0/clk_out1] \
  [get_bd_pins coreclk] [get_bd_pins armv7_processing_system/M_AXI_GP0_ACLK] \
  [get_bd_pins armv7_processing_system/S_AXI_HP0_ACLK] [get_bd_pins proc_sys_reset_0/slowest_sync_clk] \
  [get_bd_pins axi3_to_lite_pc/aclk] [get_bd_pins axi_crossbar_0/aclk] [get_bd_pins axi_gpio_0/s_axi_aclk] \
  [get_bd_pins axi_protocol_converter_0/aclk]
connect_bd_net [get_bd_pins proc_sys_reset_0/peripheral_aresetn] [get_bd_pins uncore_aresetn] [get_bd_pins axi_gpio_0/s_axi_aresetn]
connect_bd_net [get_bd_pins axi_gpio_0/gpio_io_o] [get_bd_pins noop_aresetn]
connect_bd_net [get_bd_pins clk_wiz_0/locked] [get_bd_pins dcm_locked] [get_bd_pins proc_sys_reset_0/dcm_locked]
connect_bd_net [get_bd_pins clk_wiz_0/clk_out3] [get_bd_pins vgaclk]

current_bd_instance /uncore
connect_bd_intf_net [get_bd_intf_pins axi_clock_converter_0/M_AXI] [get_bd_intf_pins axi_vga_0/axi]
connect_bd_intf_net [get_bd_intf_pins axi_crossbar_peripheral/M00_AXI] [get_bd_intf_pins axi_protocol_convert_0/S_AXI]
connect_bd_intf_net [get_bd_intf_pins axi_protocol_convert_0/M_AXI] [get_bd_intf_pins axi_uartlite_0/S_AXI]
connect_bd_intf_net [get_bd_intf_pins axi_crossbar_peripheral/M02_AXI] [get_bd_intf_pins axi_protocol_convert_1/S_AXI]
connect_bd_intf_net [get_bd_intf_pins axi_protocol_convert_1/M_AXI] [get_bd_intf_pins axi_gpio_trap/S_AXI]
connect_bd_intf_net [get_bd_intf_pins axi_protocol_convert_2/M_AXI] [get_bd_intf_pins axi_clock_converter_0/S_AXI]
connect_bd_intf_net [get_bd_intf_pins axi_protocol_convert_2/S_AXI] [get_bd_intf_pins axi_crossbar_peripheral/M01_AXI]
connect_bd_intf_net [get_bd_intf_pins axi_protocol_convert_3/M_AXI] [get_bd_intf_pins axi_crossbar_peripheral/S02_AXI]
connect_bd_intf_net [get_bd_intf_pins VGA] [get_bd_intf_pins axi_vga_0/VGA]
connect_bd_intf_net -intf_net S_AXI_DEVICE_1 [get_bd_intf_pins imem] [get_bd_intf_pins axi_crossbar_peripheral/S00_AXI]
connect_bd_intf_net -intf_net S_AXI_ZYNQ_1 [get_bd_intf_pins dmem] [get_bd_intf_pins axi_crossbar_peripheral/S01_AXI]
connect_bd_intf_net [get_bd_intf_pins UART] [get_bd_intf_pins axi_uartlite_0/UART]
connect_bd_intf_net [get_bd_intf_pins M_AXI_MEM] [get_bd_intf_pins axi_crossbar_peripheral/M03_AXI]
connect_bd_intf_net [get_bd_intf_pins zynq_ctrl] [get_bd_intf_pins axi_protocol_convert_3/S_AXI]
connect_bd_net [get_bd_pins proc_sys_reset_0/interconnect_aresetn] [get_bd_pins axi_clock_converter_0/m_axi_aresetn]
connect_bd_net [get_bd_pins proc_sys_reset_0/peripheral_aresetn] [get_bd_pins axi_vga_0/axi_resetn]
connect_bd_net -net clk_1 [get_bd_pins uncoreclk] \
  [get_bd_pins axi_clock_converter_0/s_axi_aclk] [get_bd_pins axi_crossbar_peripheral/aclk] \
  [get_bd_pins axi_uartlite_0/s_axi_aclk] [get_bd_pins axi_gpio_trap/s_axi_aclk] [get_bd_pins axi_protocol_convert_0/aclk] \
  [get_bd_pins axi_protocol_convert_1/aclk] [get_bd_pins axi_protocol_convert_2/aclk] \
  [get_bd_pins axi_protocol_convert_3/aclk]
connect_bd_net -net zynq_interconnect_aresetn_1 [get_bd_pins uncore_aresetn] \
  [get_bd_pins proc_sys_reset_0/ext_reset_in] [get_bd_pins axi_clock_converter_0/s_axi_aresetn] \
  [get_bd_pins axi_crossbar_peripheral/aresetn] [get_bd_pins axi_uartlite_0/s_axi_aresetn] \
  [get_bd_pins axi_gpio_trap/s_axi_aresetn] [get_bd_pins axi_protocol_convert_0/aresetn] \
  [get_bd_pins axi_protocol_convert_1/aresetn] [get_bd_pins axi_protocol_convert_2/aresetn] \
  [get_bd_pins axi_protocol_convert_3/aresetn]
connect_bd_net [get_bd_pins axi_gpio_trap/gpio_io_o] [get_bd_pins GPIO_trap] [get_bd_pins axi_gpio_trap/gpio2_io_i]
connect_bd_net [get_bd_pins vgaclk] \
  [get_bd_pins proc_sys_reset_0/slowest_sync_clk] [get_bd_pins axi_clock_converter_0/m_axi_aclk] \
  [get_bd_pins axi_vga_0/axi_clk] [get_bd_pins axi_vga_0/vga_clk]

current_bd_instance /
connect_bd_intf_net [get_bd_intf_pins uncore/M_AXI_MEM] [get_bd_intf_pins zynq/S_AXI_MEM]
connect_bd_intf_net [get_bd_intf_pins core/io_imem] [get_bd_intf_pins uncore/imem]
connect_bd_intf_net [get_bd_intf_pins core/io_dmem] [get_bd_intf_pins uncore/dmem]
connect_bd_intf_net [get_bd_intf_pins zynq/M_AXI_ZYNQ] [get_bd_intf_pins uncore/zynq_ctrl]
connect_bd_intf_net [get_bd_intf_ports VGA] [get_bd_intf_pins uncore/VGA]
connect_bd_net -net proc_sys_reset_0_peripheral_aresetn [get_bd_pins zynq/uncore_aresetn] [get_bd_pins uncore/uncore_aresetn]
connect_bd_net -net uncoreclk_1 [get_bd_pins zynq/coreclk] [get_bd_pins core/coreclk] [get_bd_pins uncore/uncoreclk]
connect_bd_net -net dcm_locked_1 [get_bd_pins zynq/dcm_locked] [get_bd_pins core/dcm_locked]
connect_bd_net [get_bd_pins zynq/noop_aresetn] [get_bd_pins core/reset]
connect_bd_net [get_bd_pins zynq/vgaclk] [get_bd_pins uncore/vgaclk]
connect_bd_net [get_bd_pins uncore/UART_txd] [get_bd_pins uart_flip_0/in_txd]
connect_bd_net -net UART_rxd_1 [get_bd_pins uart_flip_0/in_rxd] [get_bd_pins uncore/UART_rxd]
connect_bd_net [get_bd_pins uart_flip_0/out_txd] [get_bd_pins zynq/UART_0_rxd]
connect_bd_net [get_bd_pins zynq/UART_0_txd] [get_bd_pins uart_flip_0/out_rxd]

# ---- address map ----
assign_bd_address -offset 0x41200000 -range 64K -target_address_space [get_bd_addr_spaces zynq/armv7_processing_system/Data] [get_bd_addr_segs zynq/axi_gpio_0/S_AXI/Reg]

validate_bd_design
save_bd_design
